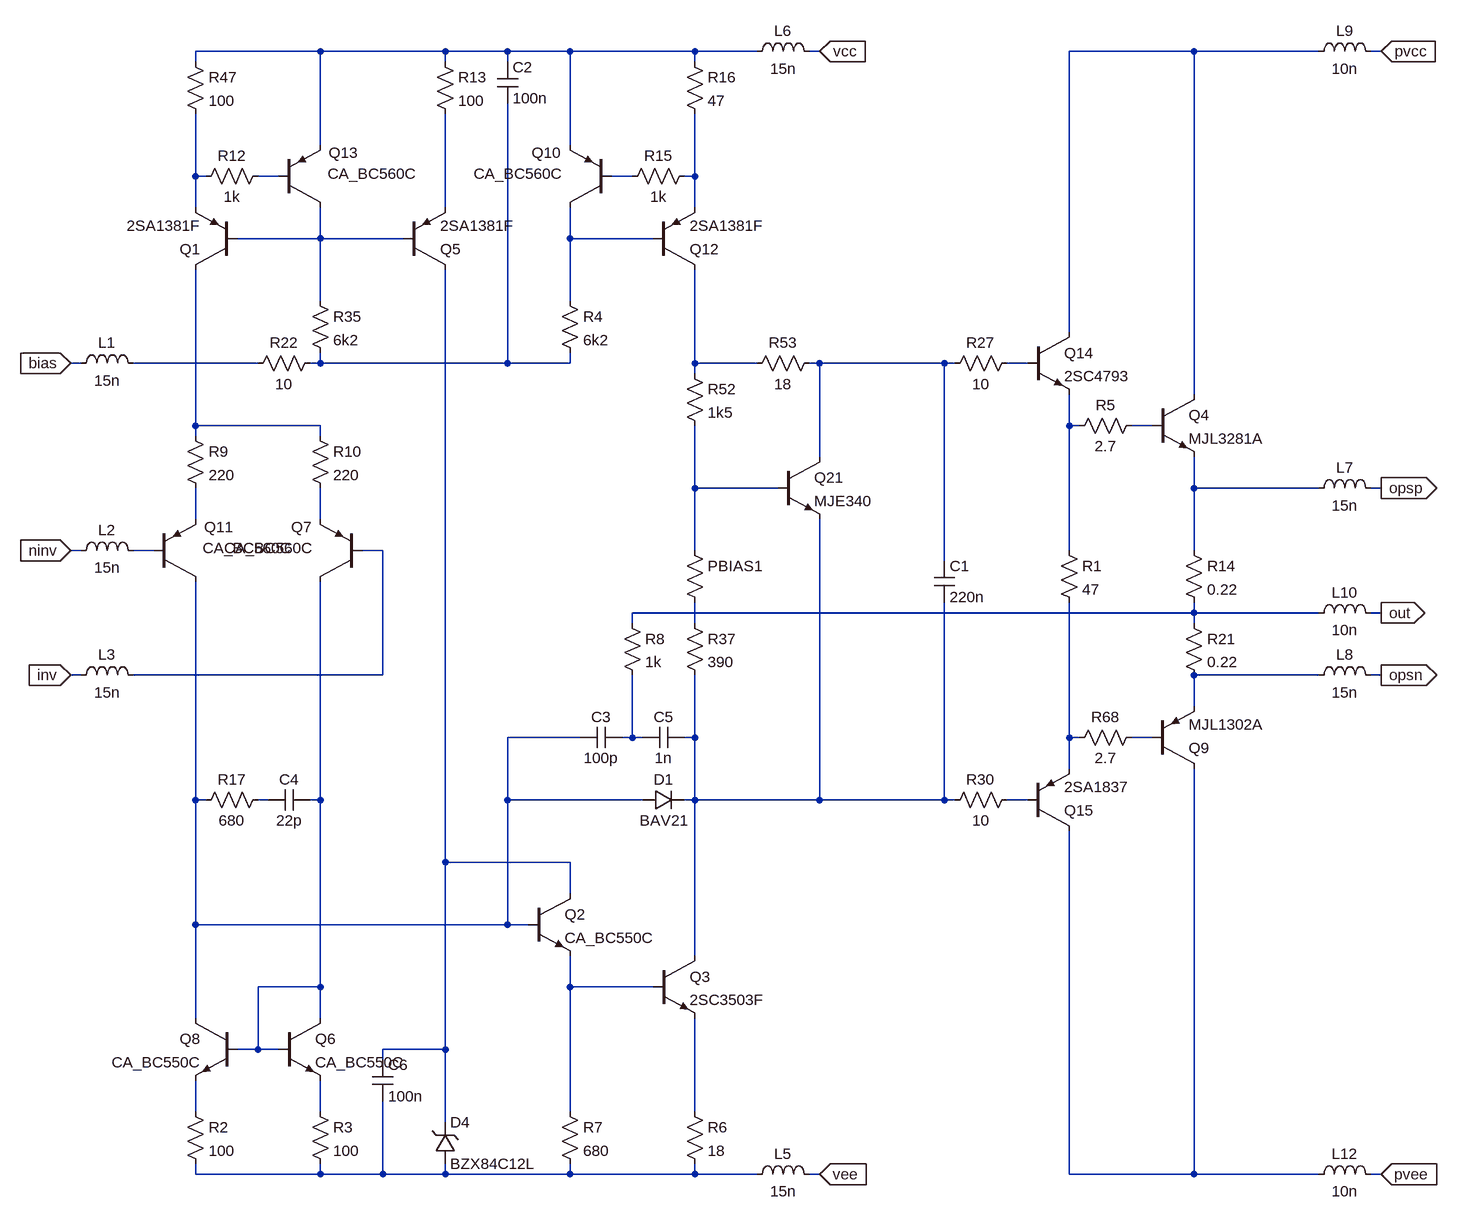
[diagram p0: schematic pab3bbb-arguo-module.asc]
pab3bbb-arguo-module.asc, the LTspice schematic file:
Version 4
SHEET 1 6124 2336
WIRE 192 -1088 0 -1088
WIRE 384 -1088 192 -1088
WIRE 480 -1088 384 -1088
WIRE 576 -1088 480 -1088
WIRE 768 -1088 576 -1088
WIRE 864 -1088 768 -1088
WIRE 960 -1088 944 -1088
WIRE 1536 -1088 1344 -1088
WIRE 1728 -1088 1536 -1088
WIRE 1824 -1088 1808 -1088
WIRE 0 -1072 0 -1088
WIRE 384 -1072 384 -1088
WIRE 480 -1072 480 -1088
WIRE 768 -1072 768 -1088
WIRE 192 -944 192 -1088
WIRE 576 -944 576 -1088
WIRE 0 -896 0 -992
WIRE 16 -896 0 -896
WIRE 128 -896 96 -896
WIRE 672 -896 640 -896
WIRE 768 -896 768 -992
WIRE 768 -896 752 -896
WIRE 0 -848 0 -896
WIRE 384 -848 384 -992
WIRE 768 -848 768 -896
WIRE 192 -800 192 -848
WIRE 192 -800 64 -800
WIRE 320 -800 192 -800
WIRE 576 -800 576 -848
WIRE 704 -800 576 -800
WIRE 192 -704 192 -800
WIRE 576 -704 576 -800
WIRE 1344 -656 1344 -1088
WIRE -176 -608 -192 -608
WIRE 96 -608 -96 -608
WIRE 192 -608 192 -624
WIRE 192 -608 176 -608
WIRE 480 -608 480 -1008
WIRE 480 -608 192 -608
WIRE 576 -608 576 -624
WIRE 576 -608 480 -608
WIRE 768 -608 768 -752
WIRE 864 -608 768 -608
WIRE 960 -608 944 -608
WIRE 1152 -608 960 -608
WIRE 1168 -608 1152 -608
WIRE 1280 -608 1248 -608
WIRE 768 -592 768 -608
WIRE 1536 -560 1536 -1088
WIRE 0 -512 0 -752
WIRE 192 -512 0 -512
WIRE 1344 -512 1344 -560
WIRE 1360 -512 1344 -512
WIRE 1472 -512 1440 -512
WIRE 0 -496 0 -512
WIRE 192 -496 192 -512
WIRE 960 -464 960 -608
WIRE 768 -416 768 -512
WIRE 896 -416 768 -416
WIRE 1536 -416 1536 -464
WIRE 1728 -416 1536 -416
WIRE 1824 -416 1808 -416
WIRE 0 -368 0 -416
WIRE 192 -368 192 -416
WIRE -176 -320 -192 -320
WIRE -64 -320 -96 -320
WIRE 288 -320 256 -320
WIRE 768 -320 768 -416
WIRE 1344 -320 1344 -512
WIRE 1536 -320 1536 -416
WIRE 1152 -304 1152 -608
WIRE 1536 -224 1536 -240
WIRE 1536 -224 672 -224
WIRE 1728 -224 1536 -224
WIRE 1824 -224 1808 -224
WIRE 672 -208 672 -224
WIRE 768 -208 768 -240
WIRE 1536 -208 1536 -224
WIRE -176 -128 -192 -128
WIRE 288 -128 288 -320
WIRE 288 -128 -96 -128
WIRE 1728 -128 1536 -128
WIRE 1824 -128 1808 -128
WIRE 1536 -80 1536 -128
WIRE 592 -32 480 -32
WIRE 672 -32 672 -128
WIRE 672 -32 656 -32
WIRE 688 -32 672 -32
WIRE 768 -32 768 -128
WIRE 768 -32 752 -32
WIRE 1344 -32 1344 -240
WIRE 1360 -32 1344 -32
WIRE 1472 -32 1440 -32
WIRE 1344 16 1344 -32
WIRE 0 64 0 -272
WIRE 16 64 0 64
WIRE 112 64 96 64
WIRE 192 64 192 -272
WIRE 192 64 176 64
WIRE 480 64 480 -32
WIRE 688 64 480 64
WIRE 768 64 768 -32
WIRE 768 64 752 64
WIRE 960 64 960 -368
WIRE 960 64 768 64
WIRE 1152 64 1152 -240
WIRE 1152 64 960 64
WIRE 1168 64 1152 64
WIRE 1280 64 1248 64
WIRE 384 160 384 -752
WIRE 576 160 384 160
WIRE 576 208 576 160
WIRE 0 256 0 64
WIRE 480 256 480 64
WIRE 480 256 0 256
WIRE 512 256 480 256
WIRE 768 304 768 64
WIRE 192 352 192 64
WIRE 192 352 96 352
WIRE 576 352 576 304
WIRE 704 352 576 352
WIRE 0 400 0 256
WIRE 192 400 192 352
WIRE 96 448 96 352
WIRE 96 448 64 448
WIRE 128 448 96 448
WIRE 384 448 384 160
WIRE 384 448 288 448
WIRE 288 464 288 448
WIRE 0 544 0 496
WIRE 192 544 192 496
WIRE 576 544 576 352
WIRE 768 544 768 400
WIRE 384 560 384 448
WIRE 0 640 0 624
WIRE 192 640 192 624
WIRE 192 640 0 640
WIRE 288 640 288 528
WIRE 288 640 192 640
WIRE 384 640 384 624
WIRE 384 640 288 640
WIRE 576 640 576 624
WIRE 576 640 384 640
WIRE 768 640 768 624
WIRE 768 640 576 640
WIRE 864 640 768 640
WIRE 960 640 944 640
WIRE 1344 640 1344 112
WIRE 1536 640 1536 16
WIRE 1536 640 1344 640
WIRE 1728 640 1536 640
WIRE 1824 640 1808 640
FLAG 1824 -1088 pvcc
IOPIN 1824 -1088 In
FLAG 1824 640 pvee
IOPIN 1824 640 In
FLAG 1824 -224 out
IOPIN 1824 -224 Out
FLAG 960 -1088 vcc
IOPIN 960 -1088 In
FLAG 960 640 vee
IOPIN 960 640 In
FLAG -192 -320 ninv
IOPIN -192 -320 In
FLAG -192 -128 inv
IOPIN -192 -128 In
FLAG -192 -608 bias
IOPIN -192 -608 In
FLAG 1824 -416 opsp
IOPIN 1824 -416 Out
FLAG 1824 -128 opsn
IOPIN 1824 -128 Out
SYMBOL pnp -64 -272 M180
WINDOW 0 77 84 Left 2
WINDOW 3 75 52 Left 2
SYMATTR InstName Q11
SYMATTR Value CA_BC560C
SYMBOL res -16 528 R0
SYMATTR InstName R2
SYMATTR Value 100
SYMBOL res 176 528 R0
SYMATTR InstName R3
SYMATTR Value 100
SYMBOL res -16 -512 R0
SYMATTR InstName R9
SYMATTR Value 220
SYMBOL res 176 -512 R0
SYMATTR InstName R10
SYMATTR Value 220
SYMBOL res 752 -1088 R0
SYMATTR InstName R16
SYMATTR Value 47
SYMBOL pnp 704 -752 M180
SYMATTR InstName Q12
SYMATTR Value 2SA1381F
SYMBOL res 1264 -624 R90
WINDOW 0 0 56 VBottom 2
WINDOW 3 32 56 VTop 2
SYMATTR InstName R27
SYMATTR Value 10
SYMBOL res 1264 48 R90
WINDOW 0 0 56 VBottom 2
WINDOW 3 32 56 VTop 2
SYMATTR InstName R30
SYMATTR Value 10
SYMBOL res -16 -1088 R0
SYMATTR InstName R47
SYMATTR Value 100
SYMBOL res 752 -336 R0
WINDOW 3 36 76 Invisible 2
SYMATTR Value {1+(200*BIAS)}
SYMATTR InstName PBIAS1
SYMBOL res 752 -608 R0
SYMATTR InstName R52
SYMATTR Value 1k5
SYMBOL res 960 -624 R90
WINDOW 0 0 56 VBottom 2
WINDOW 3 32 56 VTop 2
SYMATTR InstName R53
SYMATTR Value 18
SYMBOL npn 704 304 R0
SYMATTR InstName Q3
SYMATTR Value 2SC3503F
SYMBOL res 752 528 R0
SYMATTR InstName R6
SYMATTR Value 18
SYMBOL res 560 -720 R0
SYMATTR InstName R4
SYMATTR Value 6k2
SYMBOL pnp 64 -752 R180
SYMATTR InstName Q1
SYMATTR Value 2SA1381F
SYMBOL pnp 256 -272 R180
WINDOW 0 77 84 Left 2
WINDOW 3 75 52 Left 2
SYMATTR InstName Q7
SYMATTR Value CA_BC560C
SYMBOL npn 896 -464 R0
SYMATTR InstName Q21
SYMATTR Value MJE340
SYMBOL res 752 -224 R0
SYMATTR InstName R37
SYMATTR Value 390
SYMBOL npn 1472 -560 R0
SYMATTR InstName Q4
SYMATTR Value MJL3281A
SYMBOL pnp 1472 16 M180
SYMATTR InstName Q9
SYMATTR Value MJL1302A
SYMBOL res 1456 -528 R90
WINDOW 0 0 56 VBottom 2
WINDOW 3 32 56 VTop 2
SYMATTR InstName R5
SYMATTR Value 2.7
SYMBOL res 1456 -48 R90
WINDOW 0 0 56 VBottom 2
WINDOW 3 32 56 VTop 2
SYMATTR InstName R68
SYMATTR Value 2.7
SYMBOL cap 656 -48 R90
WINDOW 0 0 32 VBottom 2
WINDOW 3 32 32 VTop 2
SYMATTR InstName C3
SYMATTR Value 100p
SYMATTR SpiceLine V=100 Irms=20.8m Rser=5.448 Lser=3n Rpar=6.4meg Cpar=1p
SYMBOL npn 128 400 R0
SYMATTR InstName Q6
SYMATTR Value CA_BC550C
SYMBOL npn 64 400 M0
SYMATTR InstName Q8
SYMATTR Value CA_BC550C
SYMBOL res 768 -912 R90
WINDOW 0 0 56 VBottom 2
WINDOW 3 32 56 VTop 2
SYMATTR InstName R15
SYMATTR Value 1k
SYMBOL npn 512 208 R0
SYMATTR InstName Q2
SYMATTR Value CA_BC550C
SYMBOL res 560 528 R0
SYMATTR InstName R7
SYMATTR Value 680
SYMBOL cap 752 -48 R90
WINDOW 0 0 32 VBottom 2
WINDOW 3 32 32 VTop 2
SYMATTR InstName C5
SYMATTR Value 1n
SYMATTR SpiceLine V=100 Irms=75.3m Rser=2.89088 Lser=3n Rpar=4.4meg Cpar=1p
SYMBOL res 656 -224 R0
SYMATTR InstName R8
SYMATTR Value 1k
SYMBOL diode 688 80 R270
WINDOW 0 32 32 VTop 2
WINDOW 3 0 32 VBottom 2
SYMATTR InstName D1
SYMATTR Value BAV21
SYMBOL pnp 640 -848 R180
WINDOW 0 77 84 Left 2
WINDOW 3 75 52 Left 2
SYMATTR InstName Q10
SYMATTR Value CA_BC560C
SYMBOL res 1520 -336 R0
SYMATTR InstName R14
SYMATTR Value 0.22
SYMBOL res 1520 -224 R0
SYMATTR InstName R21
SYMATTR Value 0.22
SYMBOL res 176 -720 R0
SYMATTR InstName R35
SYMATTR Value 6k2
SYMBOL cap 272 528 M180
WINDOW 0 24 56 Left 2
WINDOW 3 24 8 Left 2
SYMATTR InstName C6
SYMATTR Value 100n
SYMATTR SpiceLine V=100 Irms=1.2 Rser=0.0758696 Lser=3n Rpar=4.4meg Cpar=1p
SYMBOL cap 1136 -240 M180
WINDOW 0 24 56 Left 2
WINDOW 3 24 8 Left 2
SYMATTR InstName C1
SYMATTR Value 220n
SYMATTR SpiceLine V=25 Irms=1.76 Rser=0.057522 Lser=3n Rpar=4.4meg Cpar=1p
SYMBOL ind 848 656 R270
WINDOW 0 32 56 VTop 2
WINDOW 3 5 56 VBottom 2
SYMATTR InstName L5
SYMATTR Value 15n
SYMATTR SpiceLine Rser=20m
SYMBOL ind 848 -1072 R270
WINDOW 0 32 56 VTop 2
WINDOW 3 5 56 VBottom 2
SYMATTR InstName L6
SYMATTR Value 15n
SYMATTR SpiceLine Rser=20m
SYMBOL ind 1712 -400 R270
WINDOW 0 32 56 VTop 2
WINDOW 3 5 56 VBottom 2
SYMATTR InstName L7
SYMATTR Value 15n
SYMATTR SpiceLine Rser=20m
SYMBOL ind 1712 -112 R270
WINDOW 0 32 56 VTop 2
WINDOW 3 5 56 VBottom 2
SYMATTR InstName L8
SYMATTR Value 15n
SYMATTR SpiceLine Rser=20m
SYMBOL ind -192 -592 R270
WINDOW 0 32 56 VTop 2
WINDOW 3 5 56 VBottom 2
SYMATTR InstName L1
SYMATTR Value 15n
SYMATTR SpiceLine Rser=20m
SYMBOL ind -192 -304 R270
WINDOW 0 32 56 VTop 2
WINDOW 3 5 56 VBottom 2
SYMATTR InstName L2
SYMATTR Value 15n
SYMATTR SpiceLine Rser=20m
SYMBOL ind -192 -112 R270
WINDOW 0 32 56 VTop 2
WINDOW 3 5 56 VBottom 2
SYMATTR InstName L3
SYMATTR Value 15n
SYMATTR SpiceLine Rser=20m
SYMBOL ind 1712 -208 R270
WINDOW 0 32 56 VTop 2
WINDOW 3 5 56 VBottom 2
SYMATTR InstName L10
SYMATTR Value 10n
SYMATTR SpiceLine Rser=10m
SYMBOL ind 1712 -1072 R270
WINDOW 0 32 56 VTop 2
WINDOW 3 5 56 VBottom 2
SYMATTR InstName L9
SYMATTR Value 10n
SYMATTR SpiceLine Rser=10m
SYMBOL ind 1712 656 R270
WINDOW 0 32 56 VTop 2
WINDOW 3 5 56 VBottom 2
SYMATTR InstName L12
SYMATTR Value 10n
SYMATTR SpiceLine Rser=10m
SYMBOL res 368 -1088 R0
SYMATTR InstName R13
SYMATTR Value 100
SYMBOL pnp 320 -752 M180
SYMATTR InstName Q5
SYMATTR Value 2SA1381F
SYMBOL cap 112 80 R270
WINDOW 0 32 32 VTop 2
WINDOW 3 0 32 VBottom 2
SYMATTR InstName C4
SYMATTR Value 22p
SYMATTR SpiceLine V=100 Irms=20.8m Rser=15.448 Lser=3n Rpar=6.4meg Cpar=1p
SYMBOL res 112 48 R90
WINDOW 0 0 56 VBottom 2
WINDOW 3 32 56 VTop 2
SYMATTR InstName R17
SYMATTR Value 680
SYMBOL zener 368 624 M180
WINDOW 0 24 64 Left 2
WINDOW 3 24 0 Left 2
SYMATTR InstName D4
SYMATTR Value BZX84C12L
SYMATTR Description Diode
SYMATTR Type diode
SYMBOL pnp 128 -848 M180
WINDOW 0 77 84 Left 2
WINDOW 3 75 52 Left 2
SYMATTR InstName Q13
SYMATTR Value CA_BC560C
SYMBOL res 112 -912 R90
WINDOW 0 0 56 VBottom 2
WINDOW 3 32 56 VTop 2
SYMATTR InstName R12
SYMATTR Value 1k
SYMBOL npn 1280 -656 R0
SYMATTR InstName Q14
SYMATTR Value 2SC4793
SYMBOL pnp 1280 112 M180
SYMATTR InstName Q15
SYMATTR Value 2SA1837
SYMBOL cap 464 -1008 M180
WINDOW 0 24 56 Left 2
WINDOW 3 24 8 Left 2
SYMATTR InstName C2
SYMATTR Value 100n
SYMATTR SpiceLine V=100 Irms=1.2 Rser=0.0758696 Lser=3n Rpar=4.4meg Cpar=1p
SYMBOL res 192 -624 R90
WINDOW 0 0 56 VBottom 2
WINDOW 3 32 56 VTop 2
SYMATTR InstName R22
SYMATTR Value 10
SYMBOL res 1328 -336 R0
SYMATTR InstName R1
SYMATTR Value 47

The netlist it stands for:
* pab3bbb-arguo-module.asc
Q11 N027 N022 N020 0 CA_BC560C
R2 N037 N040 100
R3 N038 N040 100
R9 N015 N020 220
R10 N015 N021 220
R16 N001 N006 47
Q12 N012 N009 N006 0 2SA1381F
R27 N014 N013 10
R30 N034 N029 10
R47 N001 N003 100
R§PBIAS1 N018 N025 {1+(200*BIAS)}
R52 N012 N018 1k5
R53 N013 N012 18
Q3 N029 N036 N039 0 2SC3503F
R6 N039 N040 18
R4 N009 N011 6k2
Q1 N015 N008 N003 0 2SA1381F
Q7 N033 N023 N021 0 CA_BC560C
Q21 N013 N018 N029 0 MJE340
R37 N025 N029 390
Q4 N002 N017 N019 0 MJL3281A
Q9 N041 N031 N026 0 MJL1302A
R5 N017 N016 2.7
R68 N031 N030 2.7
C3 N028 N027 100p V=100 Irms=20.8m Rser=5.448 Lser=3n Rpar=6.4meg Cpar=1p
Q6 N033 N033 N038 0 CA_BC550C
Q8 N027 N033 N037 0 CA_BC550C
R15 N006 N005 1k
Q2 N035 N027 N036 0 CA_BC550C
R7 N036 N040 680
C5 N029 N028 1n V=100 Irms=75.3m Rser=2.89088 Lser=3n Rpar=4.4meg Cpar=1p
R8 N024 N028 1k
D1 N027 N029 BAV21
Q10 N009 N005 N001 0 CA_BC560C
R14 N019 N024 0.22
R21 N024 N026 0.22
R35 N008 N011 6k2
C6 N040 N035 100n V=100 Irms=1.2 Rser=0.0758696 Lser=3n Rpar=4.4meg Cpar=1p
C1 N029 N013 220n V=25 Irms=1.76 Rser=0.057522 Lser=3n Rpar=4.4meg Cpar=1p
L5 N040 vee 15n Rser=20m
L6 N001 vcc 15n Rser=20m
L7 N019 opsp 15n Rser=20m
L8 N026 opsn 15n Rser=20m
L1 bias N010 15n Rser=20m
L2 ninv N022 15n Rser=20m
L3 inv N023 15n Rser=20m
L10 N024 out 10n Rser=10m
L9 N002 pvcc 10n Rser=10m
L12 N041 pvee 10n Rser=10m
R13 N001 N007 100
Q5 N035 N008 N007 0 2SA1381F
C4 N032 N033 22p V=100 Irms=20.8m Rser=15.448 Lser=3n Rpar=6.4meg Cpar=1p
R17 N032 N027 680
D4 N040 N035 BZX84C12L
Q13 N008 N004 N001 0 CA_BC560C
R12 N004 N003 1k
Q14 N002 N014 N016 0 2SC4793
Q15 N041 N034 N030 0 2SA1837
C2 N011 N001 100n V=100 Irms=1.2 Rser=0.0758696 Lser=3n Rpar=4.4meg Cpar=1p
R22 N011 N010 10
R1 N016 N030 47
.model D D
.lib standard.dio
.model NPN NPN
.model PNP PNP
.lib standard.bjt
.backanno
.end